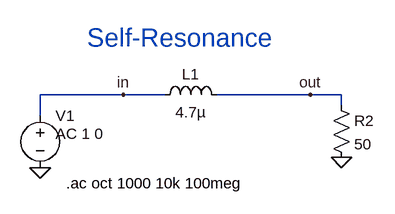
[diagram p0: schematic SRF.asc]
SRF.asc, the LTspice schematic file:
Version 4
SHEET 1 1048 680
WIRE 32 160 -96 160
WIRE 96 160 32 160
WIRE 320 160 176 160
WIRE 368 160 320 160
WIRE 368 176 368 160
WIRE -96 192 -96 160
FLAG 32 160 in
FLAG 320 160 out
FLAG -96 272 0
FLAG 368 256 0
SYMBOL voltage -96 176 R0
WINDOW 123 24 44 Left 2
WINDOW 39 0 0 Left 0
SYMATTR Value2 AC 1 0
SYMATTR InstName V1
SYMATTR Value ""
SYMBOL res 352 160 R0
SYMATTR InstName R2
SYMATTR Value 50
SYMBOL ind 80 176 R270
WINDOW 0 32 56 VTop 2
WINDOW 3 5 56 VBottom 2
SYMATTR InstName L1
SYMATTR Value 4.7µ
SYMATTR SpiceLine Ipk=9.5 Rser=0.00648 Rpar=0 Cpar=1.5p
TEXT -56 296 Left 2 !.ac oct 1000 10k 100meg
TEXT -24 72 Left 4 ;Self-Resonance

The netlist it stands for:
* SRF.asc
V1 in 0 AC 1 0
R2 out 0 50
L1 in out 4.7µ Ipk=9.5 Rser=0.00648 Rpar=0 Cpar=1.5p
.ac oct 1000 10k 100meg
* Self-Resonance
.backanno
.end